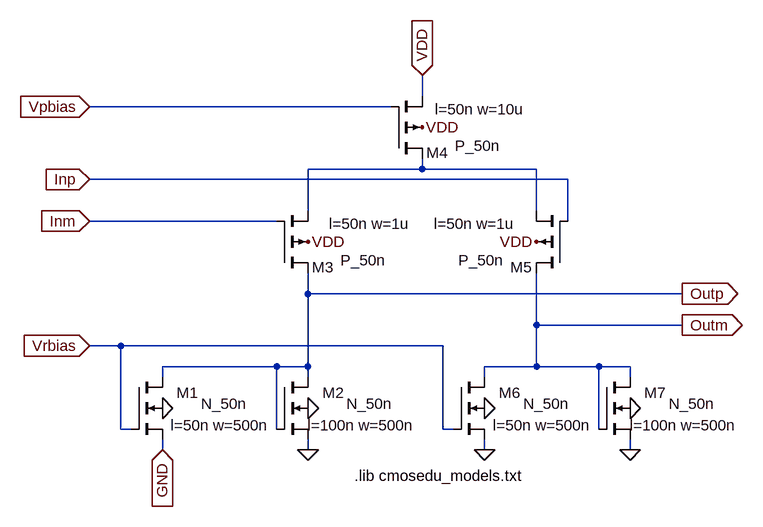
[diagram p0: schematic delay.asc]
delay.asc, the LTspice schematic file:
Version 4
SHEET 1 6288 680
WIRE 192 -224 144 -224
WIRE 192 -96 192 -224
WIRE 208 -96 192 -96
WIRE 256 -176 256 -192
WIRE 256 -64 256 -80
WIRE 432 -416 144 -416
WIRE 432 -192 256 -192
WIRE 432 -96 432 -192
WIRE 480 -432 480 -496
WIRE 480 -304 480 -336
WIRE 480 -192 432 -192
WIRE 480 -192 480 -304
WIRE 480 -176 480 -192
WIRE 480 -64 480 -80
WIRE 608 -592 144 -592
WIRE 656 -608 656 -640
WIRE 656 -496 480 -496
WIRE 656 -496 656 -512
WIRE 688 -224 192 -224
WIRE 688 -96 688 -224
WIRE 704 -96 688 -96
WIRE 752 -176 752 -192
WIRE 752 -64 752 -80
WIRE 832 -496 656 -496
WIRE 832 -432 832 -496
WIRE 832 -256 832 -336
WIRE 832 -192 752 -192
WIRE 832 -192 832 -256
WIRE 880 -480 144 -480
WIRE 880 -416 880 -480
WIRE 928 -192 832 -192
WIRE 928 -96 928 -192
WIRE 976 -192 928 -192
WIRE 976 -176 976 -192
WIRE 976 -64 976 -80
WIRE 1056 -304 480 -304
WIRE 1056 -256 832 -256
FLAG 256 -128 0
FLAG 656 -560 VDD
FLAG 480 -384 VDD
FLAG 480 -128 0
FLAG 144 -592 Vpbias
IOPIN 144 -592 In
FLAG 656 -640 VDD
IOPIN 656 -640 In
FLAG 832 -384 VDD
FLAG 144 -416 Inm
IOPIN 144 -416 In
FLAG 144 -480 Inp
IOPIN 144 -480 In
FLAG 480 -64 0
FLAG 752 -128 0
FLAG 976 -128 0
FLAG 976 -64 0
FLAG 752 -64 0
FLAG 144 -224 Vrbias
IOPIN 144 -224 In
FLAG 1056 -304 Outp
IOPIN 1056 -304 Out
FLAG 1056 -256 Outm
IOPIN 1056 -256 Out
FLAG 256 -64 GND
IOPIN 256 -64 In
SYMBOL nmos4 208 -176 R0
WINDOW 0 104 24 Right 0
WINDOW 3 179 41 Right 0
WINDOW 123 213 74 Right 0
SYMATTR InstName M1
SYMATTR Value N_50n
SYMATTR Value2 l=50n w=500n
SYMBOL pmos4 608 -512 M180
WINDOW 0 88 9 Right 0
WINDOW 3 168 20 Right 0
WINDOW 123 206 76 Right 0
SYMATTR InstName M4
SYMATTR Value P_50n
SYMATTR Value2 l=50n w=10u
SYMBOL pmos4 432 -336 M180
WINDOW 0 88 9 Right 0
WINDOW 3 168 20 Right 0
WINDOW 123 206 76 Right 0
SYMATTR InstName M3
SYMATTR Value P_50n
SYMATTR Value2 l=50n w=1u
SYMBOL nmos4 432 -176 R0
WINDOW 0 104 24 Right 0
WINDOW 3 179 41 Right 0
WINDOW 123 213 74 Right 0
SYMATTR InstName M2
SYMATTR Value N_50n
SYMATTR Value2 l=100n w=500n
SYMBOL pmos4 880 -336 R180
WINDOW 0 88 9 Right 0
WINDOW 3 168 20 Right 0
WINDOW 123 206 76 Right 0
SYMATTR InstName M5
SYMATTR Value P_50n
SYMATTR Value2 l=50n w=1u
SYMBOL nmos4 704 -176 R0
WINDOW 0 104 24 Right 0
WINDOW 3 179 41 Right 0
WINDOW 123 213 74 Right 0
SYMATTR InstName M6
SYMATTR Value N_50n
SYMATTR Value2 l=50n w=500n
SYMBOL nmos4 928 -176 R0
WINDOW 0 104 24 Right 0
WINDOW 3 179 41 Right 0
WINDOW 123 213 74 Right 0
SYMATTR InstName M7
SYMATTR Value N_50n
SYMATTR Value2 l=100n w=500n
TEXT 552 -24 Left 0 !.lib cmosedu_models.txt

The netlist it stands for:
* delay.asc
M1 Outp Vrbias GND 0 N_50n l=50n w=500n
M4 N001 Vpbias VDD VDD P_50n l=50n w=10u
M3 Outp Inm N001 VDD P_50n l=50n w=1u
M2 Outp Outp 0 0 N_50n l=100n w=500n
M5 Outm Inp N001 VDD P_50n l=50n w=1u
M6 Outm Vrbias 0 0 N_50n l=50n w=500n
M7 Outm Outm 0 0 N_50n l=100n w=500n
.model NMOS NMOS
.model PMOS PMOS
.lib standard.mos
.lib cmosedu_models.txt
.backanno
.end